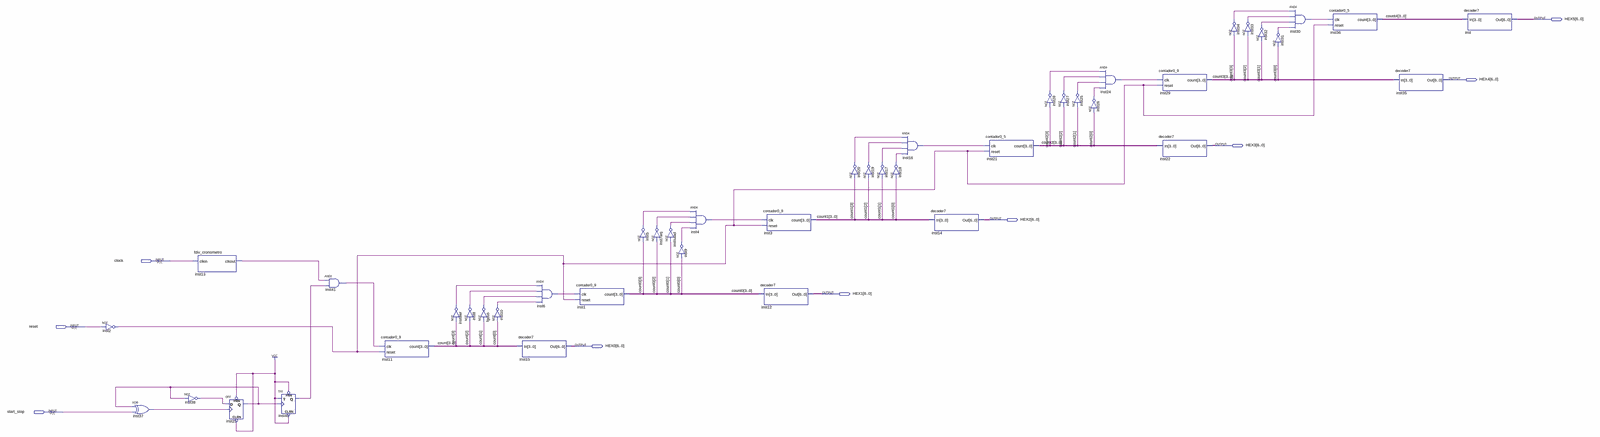
[diagram p0: schematic sheet, whole]
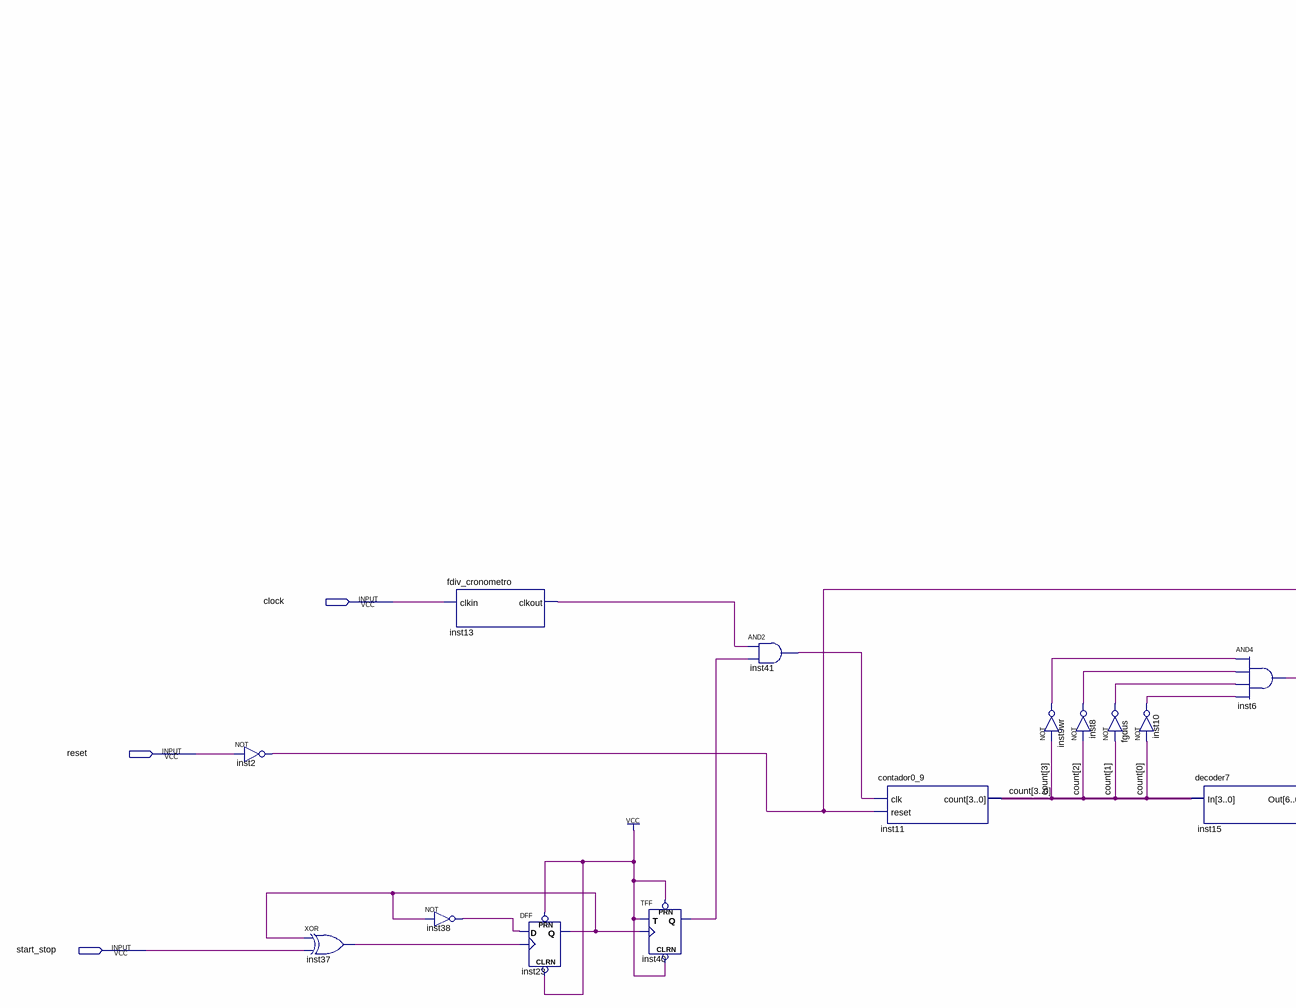
[diagram p1: schematic sheet, left part]
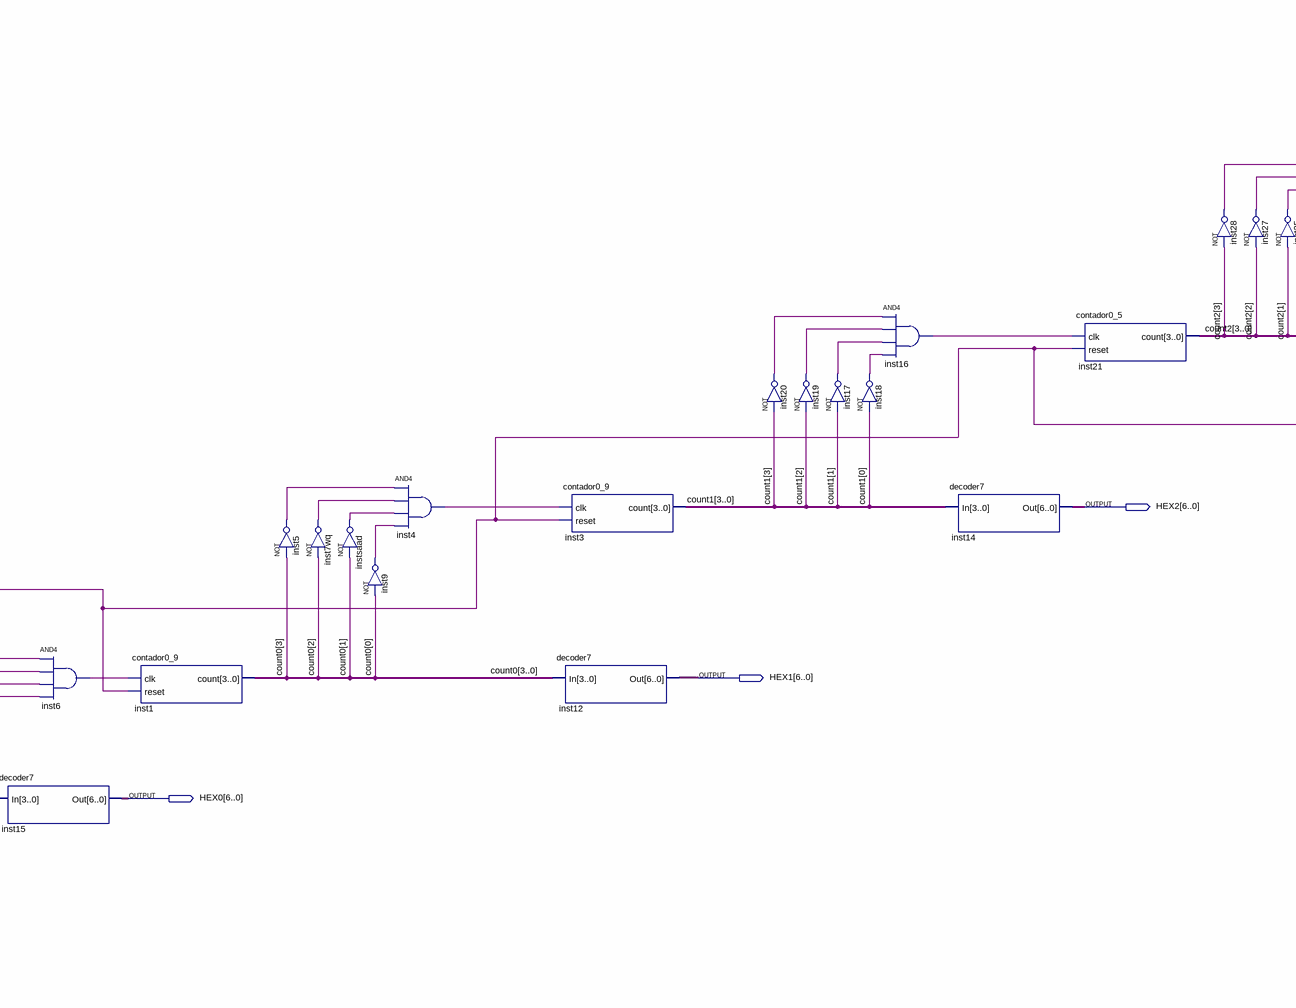
[diagram p2: schematic sheet, centre part]
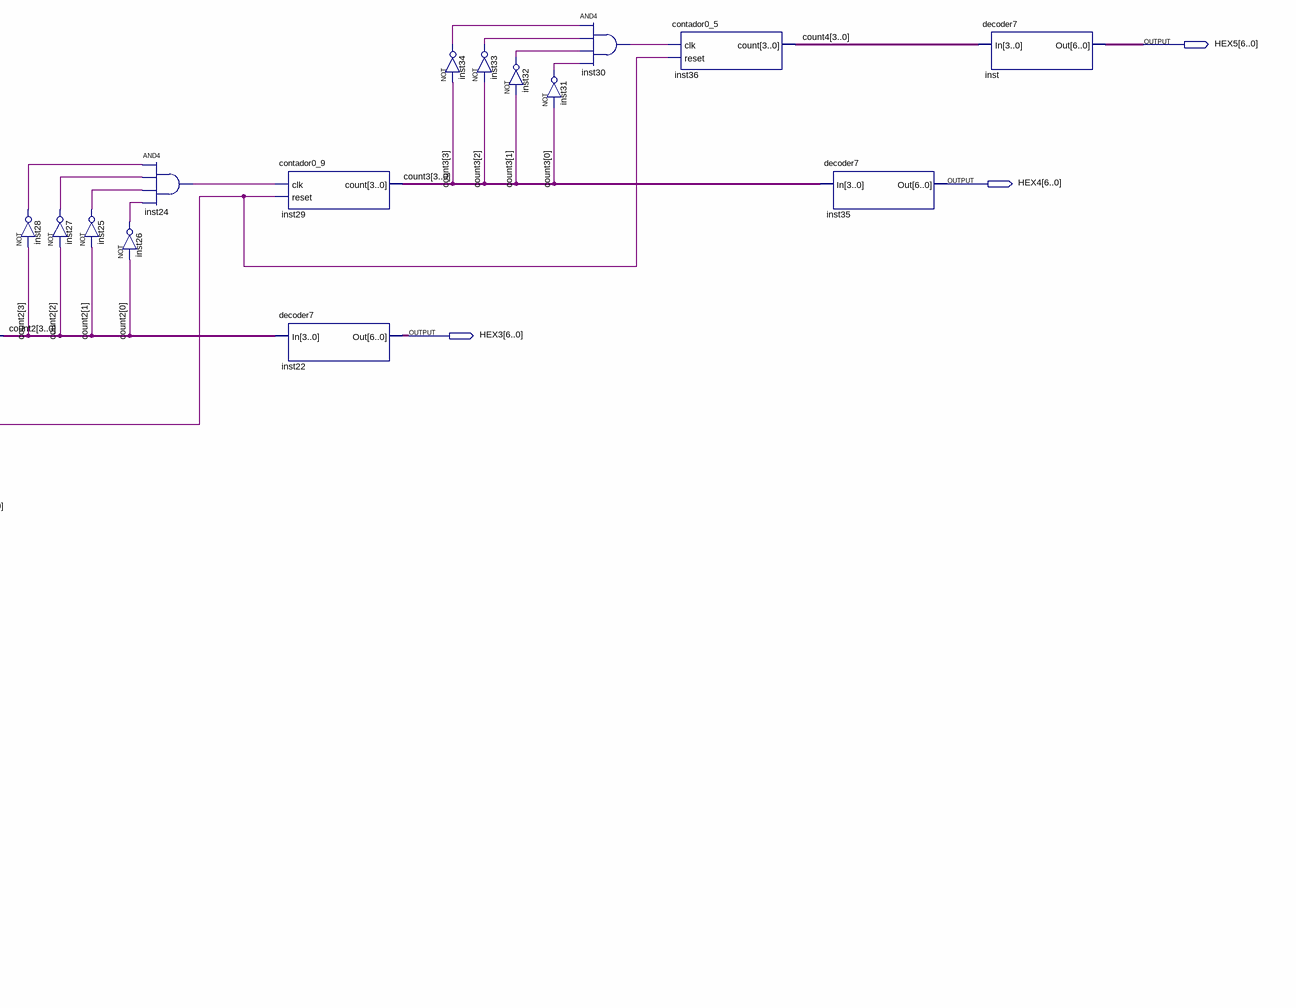
[diagram p3: schematic sheet, right part]
// Quartus schematic cronometro.bdf as structural Verilog: 44 symbols, 9 pins
module cronometro (
  input  clock,
  input  reset,
  input  start_stop,
  output [6:0] HEX5,
  output [6:0] HEX4,
  output [6:0] HEX3,
  output [6:0] HEX2,
  output [6:0] HEX1,
  output [6:0] HEX0
);

  wire fgdus_out, inst2_out, inst4_out, inst5_out, inst6_out, inst7wq_out, inst8_out, inst9_out, inst9wr_out,
       inst10_out, inst13_clkout, inst16_out, inst17_out, inst18_out, inst19_out, inst20_out, inst23_q,
       inst24_out, inst25_out, inst26_out, inst27_out, inst28_out, inst30_out, inst31_out, inst32_out,
       inst33_out, inst34_out, inst37_out, inst38_out, inst40_q, inst41_out, instsaad_out;
  wire [3:0] count, count0, count1, count2, count3, count4;

  not inst2 (inst2_out, reset);
  xor inst37 (inst37_out, inst23_q, start_stop);
  not inst38 (inst38_out, inst23_q);
  fdiv_cronometro inst13 (.clkin(clock), .clkout(inst13_clkout));
  DFF inst23 (.CLRN(1'b1), .CLK(inst37_out), .D(inst38_out), .PRN(1'b1), .Q(inst23_q));
  TFF inst40 (.PRN(1'b1), .CLRN(1'b1), .T(1'b1), .CLK(inst23_q), .Q(inst40_q));
  and inst41 (inst41_out, inst13_clkout, inst40_q);
  contador0_9 inst11 (.clk(inst41_out), .reset(inst2_out), .count(count));
  not inst8 (inst8_out, count[2]);
  not inst9wr (inst9wr_out, count[3]);
  not inst10 (inst10_out, count[0]);
  not fgdus (fgdus_out, count[1]);
  and inst6 (inst6_out, inst9wr_out, inst8_out, fgdus_out, inst10_out);
  decoder7 inst15 (.In(count), .Out(HEX0));
  contador0_9 inst1 (.clk(inst6_out), .reset(inst2_out), .count(count0));
  not inst5 (inst5_out, count0[3]);
  not instsaad (instsaad_out, count0[1]);
  not inst7wq (inst7wq_out, count0[2]);
  and inst4 (inst4_out, inst5_out, inst7wq_out, instsaad_out, inst9_out);
  not inst9 (inst9_out, count0[0]);
  contador0_9 inst3 (.clk(inst4_out), .reset(inst2_out), .count(count1));
  decoder7 inst12 (.In(count0), .Out(HEX1));
  not inst20 (inst20_out, count1[3]);
  not inst19 (inst19_out, count1[2]);
  not inst17 (inst17_out, count1[1]);
  and inst16 (inst16_out, inst20_out, inst19_out, inst17_out, inst18_out);
  not inst18 (inst18_out, count1[0]);
  decoder7 inst14 (.In(count1), .Out(HEX2));
  contador0_5 inst21 (.clk(inst16_out), .reset(inst2_out), .count(count2));
  not inst28 (inst28_out, count2[3]);
  not inst27 (inst27_out, count2[2]);
  not inst25 (inst25_out, count2[1]);
  and inst24 (inst24_out, inst28_out, inst27_out, inst25_out, inst26_out);
  not inst26 (inst26_out, count2[0]);
  contador0_9 inst29 (.clk(inst24_out), .reset(inst2_out), .count(count3));
  decoder7 inst22 (.In(count2), .Out(HEX3));
  not inst34 (inst34_out, count3[3]);
  not inst33 (inst33_out, count3[2]);
  not inst32 (inst32_out, count3[1]);
  not inst31 (inst31_out, count3[0]);
  and inst30 (inst30_out, inst34_out, inst33_out, inst32_out, inst31_out);
  contador0_5 inst36 (.clk(inst30_out), .reset(inst2_out), .count(count4));
  decoder7 inst35 (.In(count3), .Out(HEX4));
  decoder7 inst (.In(count4), .Out(HEX5));
endmodule
